# EAGLE schematic nixie-uhr (EAGLE 6.1)
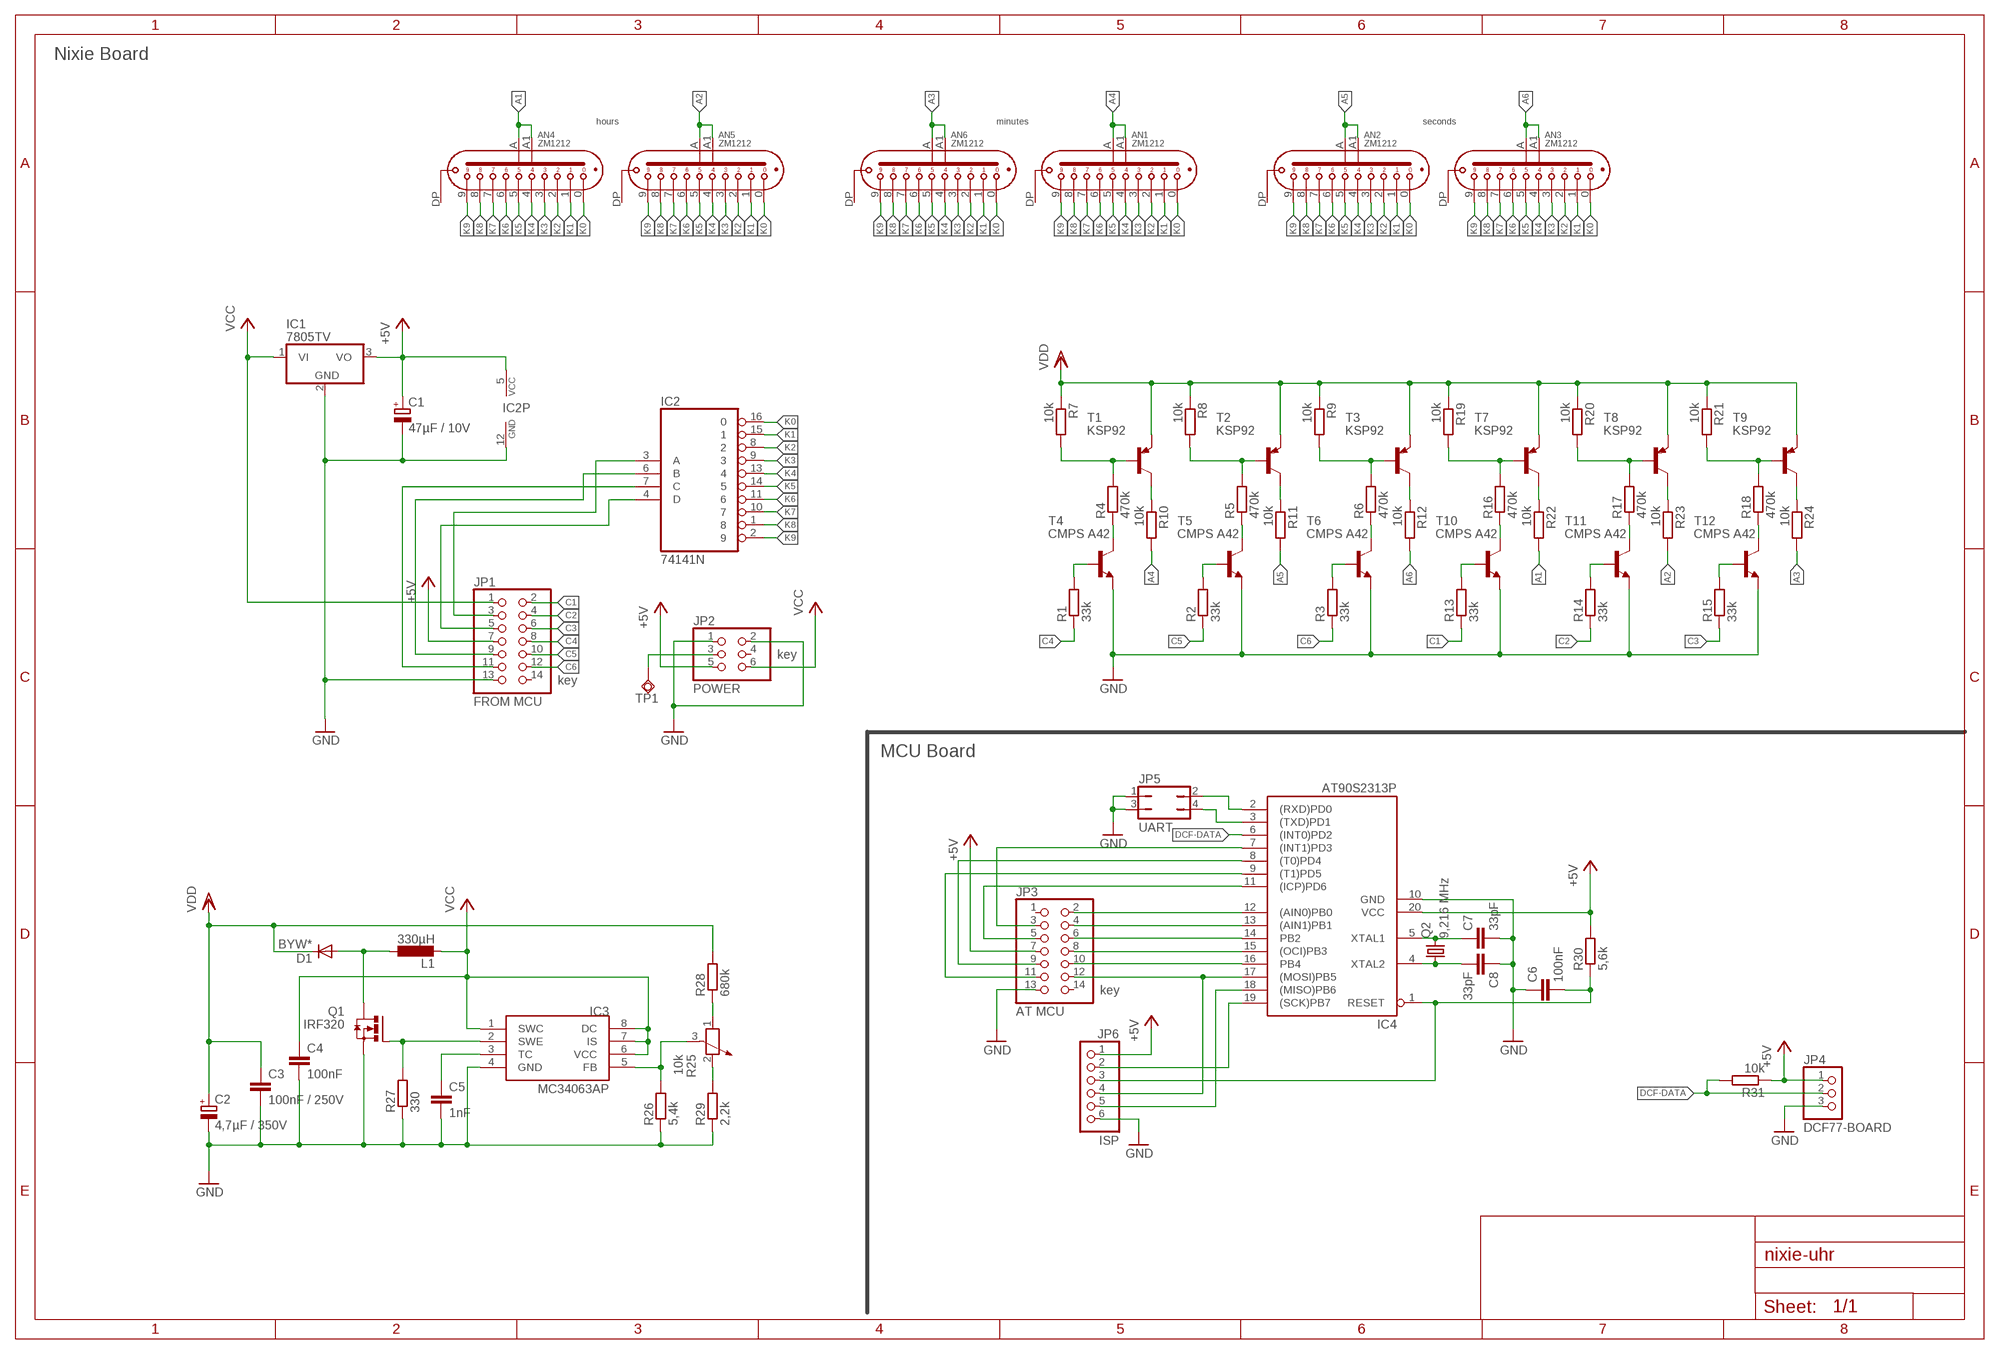
[diagram p0: schematic, sheet 1]

## Parts
AN1  ZM1212  ZM1000  [ZM1000]
AN2  ZM1212  ZM1000  [ZM1000]
AN3  ZM1212  ZM1000  [ZM1000]
AN4  ZM1212  ZM1000  [ZM1000]
AN5  ZM1212  ZM1000  [ZM1000]
AN6  ZM1212  ZM1000  [ZM1000]
C1  47µF / 10V  CPOL-EUE2.5-5  [E2,5-5]
C2  4,7µF / 350V  CPOL-EUE30-10AXIAL  [E30-10]
C3  100nF / 250V  C-EU075-052X106  [C075-052X106]
C4  100nF  C-EU050-024X044  [C050-024X044]
C5  1nF  C-EU050-024X044  [C050-024X044]
C6  100nF  C-EU050-024X044  [C050-024X044]
C7  33pF  C-EU050-024X044  [C050-024X044]
C8  33pF  C-EU050-024X044  [C050-024X044]
D1  BYW*  BYW32  [DO204-10]
IC1  7805TV  [TO220V]
IC2  74141N  [DIL16]
IC3  MC34063AP  [DIL08]
IC4  AT90S2313P  [DIL20]
JP1  FROM MCU  PINHD-2X7  [2X07]
JP2  POWER  PINHD-2X3  [2X03]
JP3  AT MCU  PINHD-2X7  [2X07]
JP4  DCF77-BOARD  PINHD-1X3  [1X03]
JP5  UART  JP2Q  [JP2Q]
JP6  ISP  PINHD-1X6/90  [1X06/90]
L1  330µH  L-EU0207/7  [0207/7]
Q1  IRF320  IRF3704S  [D2PACK]
Q2  9,216 MHz  CRYSTALHC49U-H  [HC49U-H]
R1  33k  R-EU_0204/5  [0204/5]
R2  33k  R-EU_0204/5  [0204/5]
R3  33k  R-EU_0204/5  [0204/5]
R4  470k  R-EU_0204/5  [0204/5]
R5  470k  R-EU_0204/5  [0204/5]
R6  470k  R-EU_0204/5  [0204/5]
R7  10k  R-EU_0204/5  [0204/5]
R8  10k  R-EU_0204/5  [0204/5]
R9  10k  R-EU_0204/5  [0204/5]
R10  10k  R-EU_0204/5  [0204/5]
R11  10k  R-EU_0204/5  [0204/5]
R12  10k  R-EU_0204/5  [0204/5]
R13  33k  R-EU_0204/5  [0204/5]
R14  33k  R-EU_0204/5  [0204/5]
R15  33k  R-EU_0204/5  [0204/5]
R16  470k  R-EU_0204/5  [0204/5]
R17  470k  R-EU_0204/5  [0204/5]
R18  470k  R-EU_0204/5  [0204/5]
R19  10k  R-EU_0204/5  [0204/5]
R20  10k  R-EU_0204/5  [0204/5]
R21  10k  R-EU_0204/5  [0204/5]
R22  10k  R-EU_0204/5  [0204/5]
R23  10k  R-EU_0204/5  [0204/5]
R24  10k  R-EU_0204/5  [0204/5]
R25  10k  POTENTIOMETER_PT_SPIN  [PT-SPIN]
R26  5,4k  R-EU_0207/7  [0207/7]
R27  330  R-EU_0207/7  [0207/7]
R28  680k  R-EU_0309/12  [0309/12]
R29  2,2k  R-EU_0309/12  [0309/12]
R30  5,6k  R-EU_0204/5  [0204/5]
R31  10k  R-EU_0204/5  [0204/5]
T1  KSP92  -PNP-TO92  [TO92]
T2  KSP92  -PNP-TO92  [TO92]
T3  KSP92  -PNP-TO92  [TO92]
T4  CMPS A42  MPSA42-NPN-TO92-CBE  [TO92-CBE]
T5  CMPS A42  MPSA42-NPN-TO92-CBE  [TO92-CBE]
T6  CMPS A42  MPSA42-NPN-TO92-CBE  [TO92-CBE]
T7  KSP92  -PNP-TO92  [TO92]
T8  KSP92  -PNP-TO92  [TO92]
T9  KSP92  -PNP-TO92  [TO92]
T10  CMPS A42  MPSA42-NPN-TO92-CBE  [TO92-CBE]
T11  CMPS A42  MPSA42-NPN-TO92-CBE  [TO92-CBE]
T12  CMPS A42  MPSA42-NPN-TO92-CBE  [TO92-CBE]
TP1  TPSQPAD1-17  [P1-17]

## Nets
+5V: C1.+ IC1.3(VO) IC2.5(VCC) IC4.20(VCC) JP1.7 JP2.5 JP3.7 JP4.1 JP6.1 R30.2 R31.1
A1: AN4.A1(A2) AN4.A(A1) R22.2
A2: AN5.A1(A2) AN5.A(A1) R23.2
A3: AN6.A1(A2) AN6.A(A1) R24.2
A4: AN1.A1(A2) AN1.A(A1) R10.2
A5: AN2.A1(A2) AN2.A(A1) R11.2
A6: AN3.A1(A2) AN3.A(A1) R12.2
C1: JP1.2 R13.1
C2: JP1.4 R14.1
C3: JP1.6 R15.1
C4: JP1.8 R1.1
C5: JP1.10 R2.1
C6: JP1.12 R3.1
DCF-DATA: IC4.6((INT0)PD2) JP4.2 R31.2
GND: C1.- C2.- C3.2 C4.2 C5.2 C6.1 C7.2 C8.1 IC1.2(GND) IC2.12(GND) IC3.4(GND) IC4.10(GND) JP1.13 JP2.1 JP2.2 JP3.13 JP4.3 JP5.1 JP5.3 JP6.6 Q1.3(S) R26.1 R27.1 R29.1 T4.E T5.E T6.E T10.E T11.E T12.E
K0: AN1.0 AN2.0 AN3.0 AN4.0 AN5.0 AN6.0 IC2.16
K1: AN1.1 AN2.1 AN3.1 AN4.1 AN5.1 AN6.1 IC2.15
K2: AN1.2 AN2.2 AN3.2 AN4.2 AN5.2 AN6.2 IC2.8
K3: AN1.3 AN2.3 AN3.3 AN4.3 AN5.3 AN6.3 IC2.9
K4: AN1.4 AN2.4 AN3.4 AN4.4 AN5.4 AN6.4 IC2.13
K5: AN1.5 AN2.5 AN3.5 AN4.5 AN5.5 AN6.5 IC2.14
K6: AN1.6 AN2.6 AN3.6 AN4.6 AN5.6 AN6.6 IC2.11
K7: AN1.7 AN2.7 AN3.7 AN4.7 AN5.7 AN6.7 IC2.10
K8: AN1.8 AN2.8 AN3.8 AN4.8 AN5.8 AN6.8 IC2.1
K9: AN1.9 AN2.9 AN3.9 AN4.9 AN5.9 AN6.9 IC2.2
N$1: R4.1 T4.C
N$2: R5.1 T5.C
N$3: R6.1 T6.C
N$4: R4.2 R7.2 T1.2(B)
N$5: JP2.3 TP1.TP
N$6: R5.2 R8.2 T2.2(B)
N$7: IC3.2(SWE) Q1.1(G) R27.2
N$8: R1.2 T4.B
N$9: R6.2 R9.2 T3.2(B)
N$10: R3.2 T6.B
N$11: R2.2 T5.B
N$12: D1.A L1.1 Q1.2(D)
N$13: IC3.5(FB) R25.3 R26.2
N$14: R25.1 R28.1
N$15: R11.1 T2.3(C)
N$16: R12.1 T3.3(C)
N$17: C5.1 IC3.3(TC)
N$18: R25.2 R29.2
N$19: IC4.12((AIN0)PB0) JP3.2
N$20: R10.1 T1.3(C)
N$21: IC2.3(A) JP1.3
N$22: IC2.4(D) JP1.5
N$23: IC2.6(B) JP1.9
N$24: IC2.7(C) JP1.11
N$25: R13.2 T10.B
N$26: R15.2 T12.B
N$27: R14.2 T11.B
N$28: R16.1 T10.C
N$29: R17.1 T11.C
N$30: R18.1 T12.C
N$31: R16.2 R19.2 T7.2(B)
N$32: R17.2 R20.2 T8.2(B)
N$33: R18.2 R21.2 T9.2(B)
N$34: IC4.7((INT1)PD3) JP3.3
N$35: R23.1 T8.3(C)
N$36: R24.1 T9.3(C)
N$37: R22.1 T7.3(C)
N$38: IC4.13((AIN1)PB1) JP3.4
N$39: IC4.17((MOSI)PB5) JP3.12 JP6.4
N$40: IC4.16(PB4) JP3.10
N$41: IC4.15((OCI)PB3) JP3.8
N$42: IC4.14(PB2) JP3.6
N$43: IC4.11((ICP)PD6) JP3.5
N$44: IC4.3((TXD)PD1) JP5.4
N$45: IC4.8((T0)PD4) JP3.9
N$46: IC4.9((T1)PD5) JP3.11
N$47: C7.1 IC4.5(XTAL1) Q2.2
N$48: C8.2 IC4.4(XTAL2) Q2.1
N$49: C6.2 IC4.1(RESET) JP6.3 R30.1
N$50: IC4.2((RXD)PD0) JP5.2
N$52: IC4.18((MISO)PB6) JP6.5
N$53: IC4.19((SCK)PB7) JP6.2
VCC: C4.1 IC1.1(VI) IC3.1(SWC) IC3.6(VCC) IC3.7(IS) IC3.8(DC) JP1.1 JP2.6 L1.2
VDD: C2.+ C3.1 D1.C R7.1 R8.1 R9.1 R19.1 R20.1 R21.1 R28.2 T1.1(E) T2.1(E) T3.1(E) T7.1(E) T8.1(E) T9.1(E)
Unconnected: AN1.DP(DPL) AN2.DP(DPL) AN3.DP(DPL) AN4.DP(DPL) AN5.DP(DPL) AN6.DP(DPL) JP1.14 JP2.4 JP3.1 JP3.14

## Notes on the sheet
- Nixie Board
- hours | minutes | seconds
- key
- key
- MCU Board
- key

## Library data of the parts
AN1-AN6 = nixie_tube:ZM1000: Indicator Tube (numeral height 14mm, no filter, side view, long-life typ)
C1 C2 = rcl:CPOL-EU: POLARIZED CAPACITOR, European symbol
C3-C8 = rcl:C-EU: CAPACITOR, European symbol
D1 = diode:BYW32: DIODE fast silicon-mesa rectifier (Vishay Telefunken)
IC1 = linear:78*: Positive VOLTAGE REGULATOR Source: http://cache.national.com/ds/LM/LM78L05.pdf http://www.fairchildsemi.com/ds/LM/LM7805.pdf
IC2 = 74xx-eu:74*141: BCD to decimal DECODER/DRIVER
IC3 = mc34063:MC34063
IC4 = atmel:AT90S2313: MICROCONTROLLER 2 Kbytes FLASH 128 bytes SRAM 128 bytes EEPROM UART; OC_FARNELL: unknown; OC_NEWARK: unknown
JP1 JP3 = pinhead:PINHD-2X7: PIN HEADER
JP2 = pinhead:PINHD-2X3: PIN HEADER
JP4 = pinhead:PINHD-1X3: PIN HEADER
JP5 = jumper:JP2Q: JUMPER
JP6 = pinhead:PINHD-1X6: PIN HEADER
L1 = rcl:L-EU: INDUCTOR, European symbol
Q1 = transistor-power:IRF3704: SMPS MOSFET HEXFET® Power MOSFET Source: http://www.irf.com/product-info/datasheets/data/irf3704.pdf
Q2 = crystal:CRYSTAL: CRYSTAL; OC_FARNELL: 1666973; OC_NEWARK: unknown
R1-R24 R26-R31 = rcl:R-EU_: RESISTOR, European symbol
R25 = rcl:POTENTIOMETER_: Potentiometer
T1-T3 T7-T9 = transistor:*-PNP-: PNP Transistror
T4-T6 T10-T12 = transistor:*-NPN-: NPN Transistror BF959 corrected 2008.03.06
TP1 = testpad:TPSQ: Test pad